# Altium project trap_sensor_LD.PrjPcb
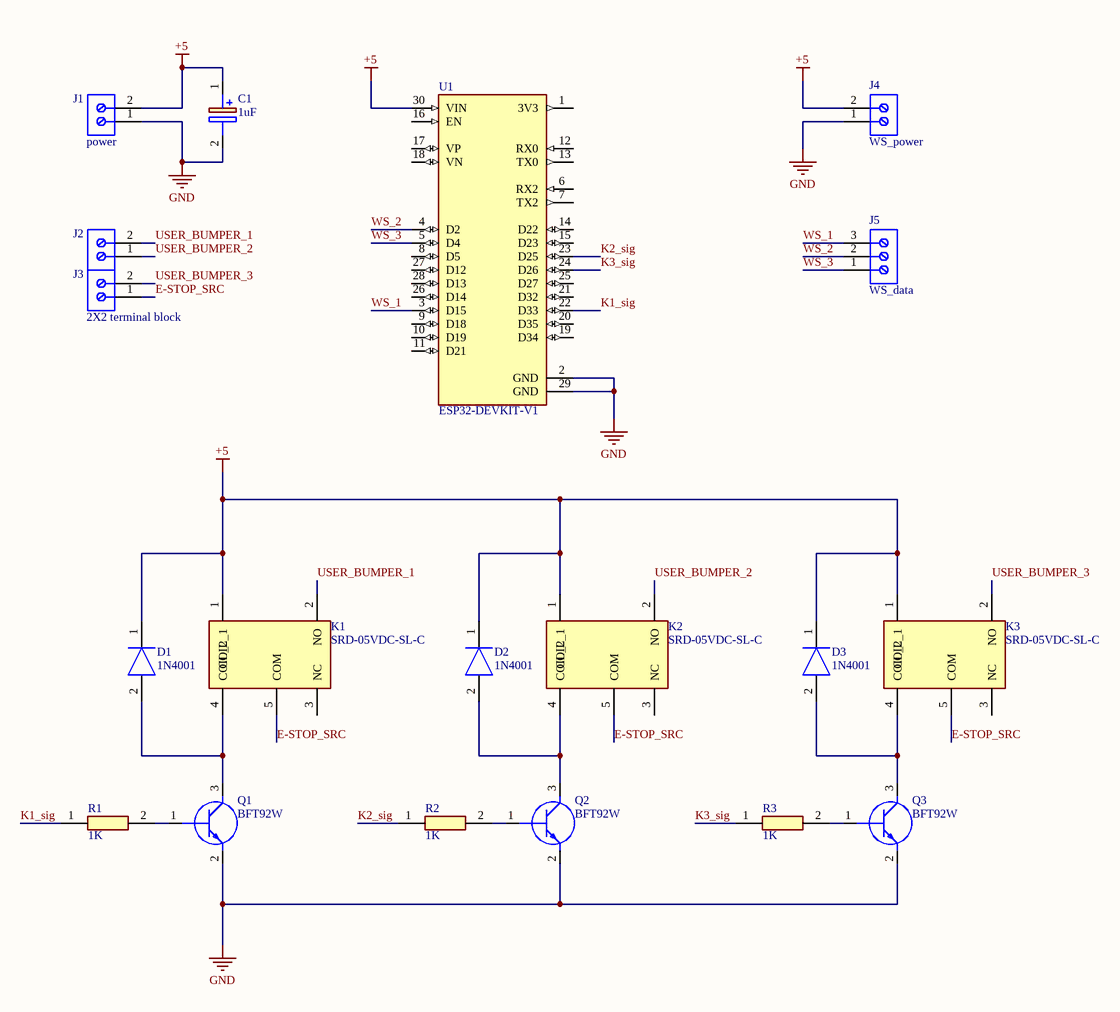
[diagram p0: trap sensor LD schematic.SchDoc]
1 sheet, 19 parts. Net scope: global (net labels, ports and power ports of the same name join across sheets).
Board file: trap sensor LD PCB.PcbDoc

## Sheet trap sensor LD schematic.SchDoc
size A3; SheetNumber: 1; SheetTotal: 1

### Parts
C1  1uF  [CAPC3225X125N]
D1  1N4001  [diode 2]
D2  1N4001  [diode 2]
D3  1N4001  [diode 2]
J1  power  [691102710002]
J2  (no value)  [691102710002]
J3  2X2 terminal block  [691102710002]
J4  WS_power  [691102710002]
J5  WS_data  [691101710003]
K1  SRD-05VDC-SL-C  [SRD05VDCSLC]
K2  SRD-05VDC-SL-C  [SRD05VDCSLC]
K3  SRD-05VDC-SL-C  [SRD05VDCSLC]
Q1  BFT92W  [SOT65P210X110-3N]
Q2  BFT92W  [SOT65P210X110-3N]
Q3  BFT92W  [SOT65P210X110-3N]
R1  1K  [resistor smd]
R2  1K  [resistor smd]
R3  1K  [resistor smd]
U1  ESP32-DEVKIT-V1  [MODULE_ESP32_DEVKIT_V1]

### Nets
+5: C1.1(+) D1.1(K) D2.1(K) D3.1(K) J1.2 J4.2 K1.1(COIL_1) K2.1(COIL_1) K3.1(COIL_1) U1.30(VIN)
GND: C1.2(-) J1.1 J4.1 Q1.2(E) Q2.2(E) Q3.2(E) U1.2(GND) U1.29(GND)
E-STOP_SRC: J3.1 K1.5(COM) K2.5(COM) K3.5(COM)
K1_sig: R1.1 U1.22(D33)
K2_sig: R2.1 U1.23(D25)
K3_sig: R3.1 U1.24(D26)
USER_BUMPER_1: J2.2 K1.2(NO)
USER_BUMPER_2: J2.1 K2.2(NO)
USER_BUMPER_3: J3.2 K3.2(NO)
WS_1: J5.3 U1.3(D15)
WS_2: J5.2 U1.4(D2)
WS_3: J5.1 U1.5(D4)
NetD1_2: D1.2(A) K1.4(COIL_2) Q1.3(C)
NetD2_2: D2.2(A) K2.4(COIL_2) Q2.3(C)
NetD3_2: D3.2(A) K3.4(COIL_2) Q3.3(C)
NetQ1_1: Q1.1(B) R1.2
NetQ2_1: Q2.1(B) R2.2
NetQ3_1: Q3.1(B) R3.2

Not connected (* = marked no-connect by the designer): K1 3(NC); K2 3(NC); K3 3(NC); U1 1(3V3) 6(RX2) 7(TX2) 8(D5) 9(D18) 10(D19) 11(D21) 12(RX0) 13(TX0) 14(D22) 15(D23) 16(EN) 17(VP) 18(VN) 19(D34) 20(D35) 21(D32) 25(D27) 26(D14) 27(D12) 28(D13)

### Library data of the parts
C1 = MAL214699103E3: Capacitor Polarised; Manufacturer_Name: Vishay; Datasheet Link: https://www.vishay.com/docs/28403/146cti.pdf; Height: 10.5mm; Manufacturer_Part_Number: MAL214699103E3; Mouser Part Number: 594-MAL214699103E3; Mouser Price/Stock: https://www.mouser.co.uk/ProductDetail/Vishay-BC-Components/MAL214699103E3?qs=Ep9Lwju7gVqGv9YdqsYr5A%3D%3D; Arrow Part Number: MAL214699103E3; Arrow Price/Stock: https://www.arrow.com/en/products/mal214699103e3/vishay
D1-D3 = 1N4001: Diode; Manufacturer_Name: Taiwan Semiconductor; Datasheet Link: http://www.taiwansemi.com/products/datasheet/1N4001 SERIES_H14.pdf; Manufacturer_Part_Number: 1N4001; Mouser Part Number: 821-1N4001; Mouser Price/Stock: https://www.mouser.co.uk/ProductDetail/Taiwan-Semiconductor/1N4001?qs=P0SCnEz%2FFstVLZNQCFODyw%3D%3D
J1-J4 = CMP-1502-03258-2: NexarPartId: 8917706; Number of Levels: 1; Number of Positions Per Level: 2; Current: 15A; Voltage: 300V; Pitch: 5.0038mm; Plating: Steel; Stripping Length: -6mm; Wire Gauge (Min): 14AWG; Wire Gauge (Max): 22AWG; Length: 7.5mm; Contact Material: Brass; Contact Plating: Tin; Packaging: Box; Number of Pins: 2; Voltage Rating: 300V; Termination: Screw; Number of Contacts: 2; Color: Blue; Current Rating: 15A; Mount: Through Hole; Max Operating Temperature: 105°C; Min Operating Temperature: -40°C; REACH SVHC: Unknown; Height: 13.4mm; Width: 11.2mm; Housing Material: Nylon; RoHS: Compliant; Wire/Cable Gauge: 22AWG; Lead Pitch: 5mm
J5 = CMP-1502-03257-2: NexarPartId: 8917705; Voltage Rating: 250V; Current: 16A; Wire Gauge (Min): 14AWG; Pitch: 5.0038mm; Wire Gauge (Max): 26AWG; Number of Positions Per Level: 3; Plating: Steel; Number of Levels: 1; Stripping Length: -7mm; REACH SVHC: Unknown; Width: 16.2mm; Height: 16.4mm; Contact Material: Brass; RoHS: Compliant; Color: Blue; Contact Plating: Tin; Lead Pitch: 5mm; Packaging: Box; Termination: Screw; Number of Contacts: 3; Wire/Cable Gauge: 26AWG; Min Operating Temperature: -40°C; Max Operating Temperature: 105°C; Housing Material: Nylon; Length: 9mm; Voltage: 250V; Mount: Through Hole; Current Rating: 16A; Number of Pins: 3
K1-K3 = SRD-05VDC-SL-C: Relay or Contactor; Manufacturer_Name: EAGLE; Datasheet Link: http://www.songlerelay.com/Public/Uploads/20161104/581c81ac16e36.pdf; Height: 15.8mm; Manufacturer_Part_Number: SRD-05VDC-SL-C
Q1-Q3 = BFT92W: Transistor BJT NPN; Manufacturer_Name: NXP; Datasheet Link: http://uk.rs-online.com/web/p/products/3803228; Height: 1.1mm; Manufacturer_Part_Number: BFT92W; Mouser Part Number: N/A; Mouser Price/Stock: https://www.mouser.co.uk/ProductDetail/NXP-Semiconductors/BFT92W/?qs=fAHHVMwC%252BbirqGt1esWTqQ%3D%3D
R1-R3 = MCU0805MD1001DP500: Resistor; Manufacturer_Name: Vishay; Datasheet Link: http://www.vishay.com/docs/28760/mcat_pro.pdf; Height: 0.62mm; Manufacturer_Part_Number: MCU0805MD1001DP500; Mouser Part Number: 594-MCU0805MD1001DP5; Arrow Part Number: MCU0805MD1001DP500; Arrow Price/Stock: https://www.arrow.com/en/products/mcu0805md1001dp500/vishay
U1 = ESP32-DEVKIT-V1: Dual core, Wi-Fi: 2.4 GHz up to 150 Mbits/s,BLE (Bluetooth Low Energy) and legacy Bluetooth, 32 bits, Up to 240 MHz; MF: Do it; Price: None; Availability: Not in stock; Package: None; MP: ESP32-DEVKIT-V1; Value: *; SnapEDA_Link: https://www.snapeda.com/parts/ESP32-DEVKIT-V1/Do+it/view-part/?ref=snap; Check_prices: https://www.snapeda.com/parts/ESP32-DEVKIT-V1/Do+it/view-part/?ref=eda